# Altium schematic sheet ISOLATED PSU.SchDoc
size A4
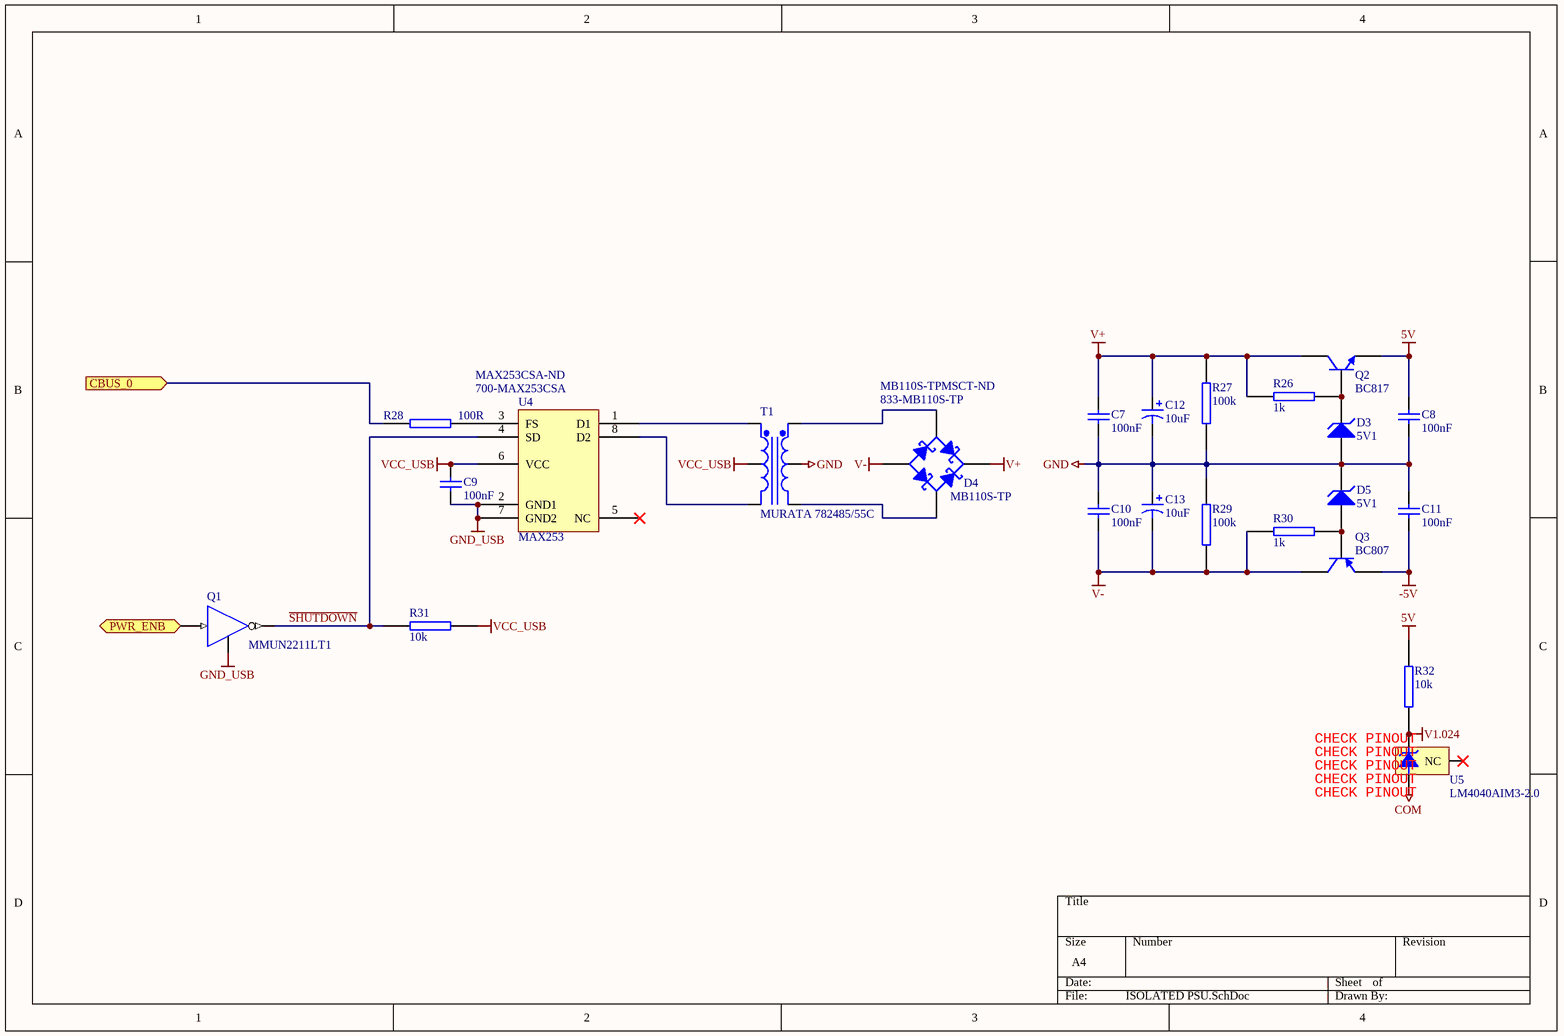
[diagram p0: ISOLATED PSU.SchDoc]

## Parts
C7  100nF  [CAP (3D) - 0603]
C8  100nF  [CAP (3D) - 0603]
C9  100nF  [CAP (3D) - 0603]
C10  100nF  [CAP (3D) - 0603]
C11  100nF  [CAP (3D) - 0603]
C12  10uF  [CAP ELECTRO SIZE-B]
C13  10uF  [CAP ELECTRO SIZE-B]
D3  5V1  [SOT23-3L]
D4  MB110S-TP  Supplier Part Number 1: 833-MB110S-TP  Supplier Part Number 2: MB110S-TPMSCT-ND  [TO-269AA]
D5  5V1  [SOT23-3L]
Q1  MMUN2211LT1  [SOT23-3L]
Q2  BC817  [SOT23-3L]
Q3  BC807  [SOT23-3L]
R26  1k  [RES (3D) - 0603]
R27  100k  [RES (3D) - 0603]
R28  100R  [RES (3D) - 0603]
R29  100k  [RES (3D) - 0603]
R30  1k  [RES (3D) - 0603]
R31  10k  [RES (3D) - 0603]
R32  10k  [RES (3D) - 0603]
T1  MURATA 782485/55C  [78248]
U4  MAX253  Supplier Part Number 1: 700-MAX253CSA  Supplier Part Number 2: MAX253CSA-ND  [SO-8C_L]
U5  LM4040AIM3-2.0  [SOT23-3L]

## Ports
CBUS_0 (in), PWR_ENB (in)

## Nets
5V: C8.2 Q2.3(E) R32.2
-5V: C11.1 Q3.1(E)
COM: U5.2(-V)
GND: C7.1 C8.1 C10.2 C11.2 C12.2 C13.1 D3.1(A) D5.2(K) R27.2 R29.1 T1.5(SecCT)
GND_USB: C9.1 Q1.2(E) U4.2(GND1) U4.7(GND2)
V1.024: R32.1 U5.1(+V)
V+: C7.2 C12.1 D4.1(K) Q2.1(C) R26.2 R27.1
V-: C10.1 C13.2 D4.3(A) Q3.3(C) R29.2 R30.2
VCC_USB: C9.2 R31.1 T1.2(PriCT) U4.6(VCC)
CBUS_0: R28.1 ; port CBUS_0
PWR_ENB: Q1.1(B) ; port PWR_ENB
~{SHUTDOWN}: Q1.3(C) R31.2 U4.4(SD)
NetD3_2: D3.2(K) Q2.2(B) R26.1
NetD4_2: D4.2(C) T1.4(Sec-)
NetD4_4: D4.4(C) T1.6(Sec+)
NetD5_1: D5.1(A) Q3.2(B) R30.1
NetR28_2: R28.2 U4.3(FS)
NetT1_1: T1.1(Pri+) U4.1(D1)
NetT1_3: T1.3(Pri-) U4.8(D2)

Not connected (* = marked no-connect by the designer): U4 5(NC)*; U5 3(NC)*

## Notes on the sheet
- (near U5) CHECK PINOUT

## Library data of the parts
C7-C11 = Cap: Capacitor; Value: 100nF; Supplier 1: Mouser; Supplier 2: Digi-Key; Supplier Part Number 1: 603-C0603ZRY5V9BB104; Supplier Part Number 2: 311-1343-2-ND
C12 C13 = Cap Pol1: Polarized Capacitor (Radial); Value: 10uF
D3 D5 = D Zener: Zener Diode; pin to pad: 2>3; Value: 5V1; Supplier 1: Mouser; Supplier Part Number 1: 625-BZX84C5V1-V; Supplier 2: Digi-Key; Supplier Part Number 2: BZX84C5V1-V-GS08CT-ND
D4 = Bridge1: Full Wave Schottky Diode Bridge; Published: 8-Jun-2000; LatestRevisionDate: 29-May-2009; LatestRevisionNote: Sch pins A & K swapped.; DatasheetVersion: E2732B; PackageReference: D-38; Publisher: Altium Limited; PackageDescription: Bridge Rectifier; 4 Terminals; Body 9.4 x 9.4 mm (typ); Pitch 5.08 mm; Value: MB110S-TP; Supplier 1: Mouser; Supplier 2: Digi-Key
Q1 = NPN DIGITAL TRANSISTOR: Manufacturer: ON SEMO; Manufacturer Part No.: MMUN2211LT1G; Mouser Part no.: 863-MMUN2211LT1G; Web link: http://au.mouser.com/ProductDetail/ON-Semiconductor/MMUN2211LT1G/?qs=ZpPixqFcBtyOBGnml%2fmJx1k1aPkM%252ba71PMQX%2fEUGWkQ%3d; value: MMUN2211; Supplier 1: Mouser; Supplier Part Number 1: 863-MMUN2211LT1G; Supplier 2: Digi-Key; Supplier Part Number 2: MMUN2211LT1GOSCT-ND
Q2 = BC817: NPN Bipolar Transistor; pin to pad: 1>3 2>1 3>2; Manufacturer: ON Semiconductor; Manufacturer Part No.: BC817-25LT1G; Revision: July-2002: Re-released for DXP Platform.; Mouser Part no.: 863-BC817-25LT1G; Farnell Part no.: 1081223; value: BC817; Web link: http://au.mouser.com/ProductDetail/ON-Semiconductor/BC817-25LT1G/?qs=sGAEpiMZZMutXGli8Ay4kJTaSFKHrKTHz5OxB%252bfaCCM%3d
Q3 = 2N3906: PNP General Purpose Amplifier; Value: BC807
R26-R31 = RES SMD 0603 100R: RESISTOR SMD 0603
  R26 R30: Value: 1k
  R27 R29: Value: 100k
  R28: Value: 100R
  R31: Value: 10k
R32 = RES SMD 0603 10k: RESISTOR SMD 0603 10k; Manufacturer: Bourns; Manufacturer Part No.: CR0603FX-1002ELF; Mouser Part no.: 652-CR0603FX-1002ELF; Web link: http://au.mouser.com/Search/Refine.aspx?Keyword=652-CR0603FX-1002ELF; value: 10k
T1 = Trans CT: Center-Tapped Transformer (Coupled Inductor Model); Published: 8-Jun-2000; LatestRevisionDate: 17-Jul-2002; LatestRevisionNote: Re-released for DXP Platform.; PackageReference: TRF_5; Publisher: Altium Limited; PackageDescription: Transformer; 5 Leads; Value: MURATA 782485/55C
U5 = LM4040AIM3-2.0: Precision Micropower Shunt Voltage Reference; Manufacturer: National Semiconductor; CompType: Voltage Reference IC; PackageTopMarking: RJA*XTT; PowerWise: N; Published: 4-Dec-2008; DatasheetVersion: Apr-2005; PackageVersion: revB, Mar-2003; PackageReference: MF03A; Publisher: Altium Limited; PackageDescription: Molded SOT-23, .115 x .051 x .037in Body, 3 Lead, .075 in Pitch; PartNumber: LM4040AIM3-2.0; RoHS: O; PinCount: 3; DigiKeyPartNumber: LM4040AIM3-2.0-ND; ComponentLink1Description: LM4040 Datasheet; ComponentLink1URL: http://www.national.com/ds/LM/LM4040.pdf; ComponentLink2Description: LM4040 Web Page; ComponentLink2URL: http://www.national.com/pf/LM/LM4040.html; ComponentLink3Description: MF03A Package Page; ComponentLink3URL: http://www.national.com/packaging/folders/mf03a.html
U4 = MAX253: Value: MAX253; Supplier 1: Mouser; Supplier 2: Digi-Key